# EAGLE design untitled (EAGLE 9.6.2)
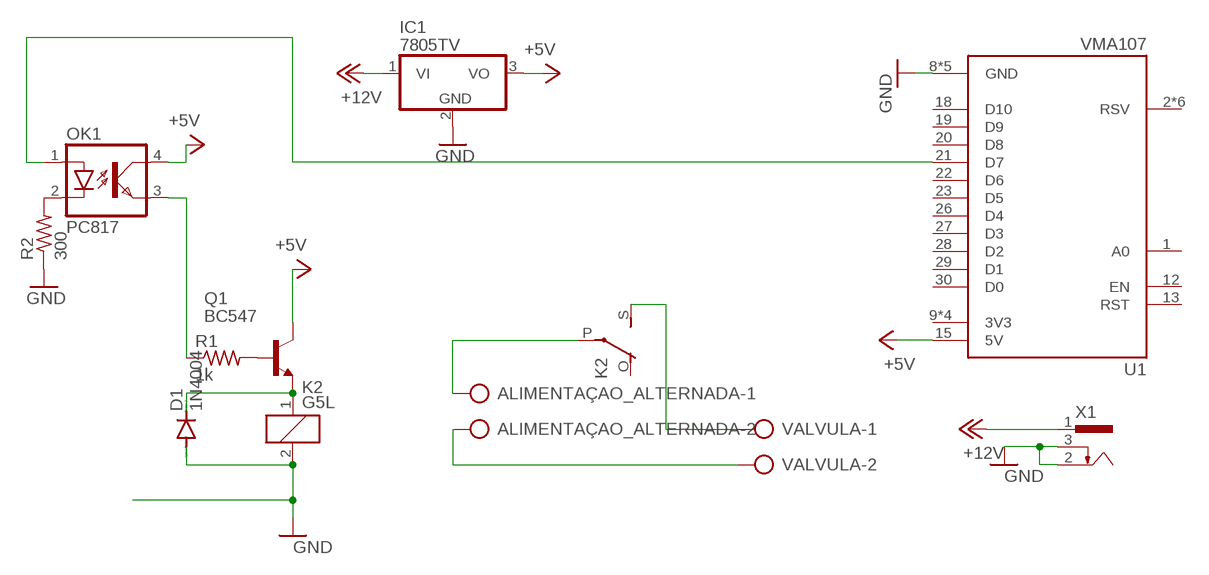
[diagram p0: schematic, sheet 1]

## Parts
ALIMENTAÇAO_ALTERNADA  AK500/2-H  [AK500/2-H]
D1  1N4004  [DO41-10]
IC1  7805TV  [TO220V]
K2  G5L  [G5LE]
OK1  PC817  [DIL04]
Q1  BC547  [TO92]
R1  1k  R-US_0204/7  [0204/7]
R2  300  R-US_0204/7  [0204/7]
U1  VMA107  [MODULE_VMA107]
VALVULA  AK500/2-H  [AK500/2-H]
X1  733980-62  [733980-62]

## Nets
+5V: IC1.3(VO) OK1.4(COL) Q1.3(C) U1.15(5V)
+12V: IC1.1(VI) X1.1
GND: D1.A IC1.2(GND) K2.2 R2.1 U1.8(GND) U1.10(GND) U1.14(GND) U1.17(GND) U1.24(GND) X1.2 X1.3
N$1: D1.C K2.1 Q1.1(E)
N$2: OK1.3(EMIT) R1.1
N$3: Q1.2(B) R1.2
N$4: OK1.2(C) R2.2
N$5: OK1.1(A) U1.21(D7)
N$6: ALIMENTAÇAO_ALTERNADA.1 K2.P(2:P)
N$7: K2.S(2:S) VALVULA.1
N$8: ALIMENTAÇAO_ALTERNADA.2 VALVULA.2
Unconnected: K2.O(2:O) U1.1(A0) U1.2(RSV) U1.3(RSV) U1.4(RSV) U1.5(RSV) U1.6(RSV) U1.7(RSV) U1.12(EN) U1.13(RST) U1.18(D10) U1.19(D9) U1.20(D8) U1.22(D6) U1.23(D5) U1.26(D4) U1.27(D3) U1.28(D2) U1.29(D1) U1.30(D0)

## Power pins joined to a net without a drawn wire
3V3: U1.9(3V3) U1.11(3V3) U1.16(3V3) U1.25(3V3)

## Library data of the parts
ALIMENTAÇAO_ALTERNADA VALVULA = con-ptr500:AK500/2-H: CONNECTOR Aug. 2004 / PTR Meßtechnik: Die Bezeichnung der Serie AK505 wurde geändert. Es handelt sich hierbei um AK500 in horizontaler Ausführung.; OC_FARNELL: unknown; OC_NEWARK: unknown
D1 = diode_longPad:1N4004: DIODE general purpose rectifier, 1 A
IC1 = linear:78*: Positive VOLTAGE REGULATOR Source: http://cache.national.com/ds/LM/LM78L05.pdf http://www.fairchildsemi.com/ds/LM/LM7805.pdf
K2 = relay:G5L: RELAY 1 x switch, 10 A/120 V AC, 8 A/30 V ADC, Omron; OC_FARNELL: unknown; OC_NEWARK: unknown
OK1 = optocoupler:PC817: SHARP OPTO COUPLER; MPN: PC817X4J000F; OC_FARNELL: 9707727; OC_NEWARK: 97K7059
Q1 = transistor-npn:BC547*: NPN Transistor
R1 R2 = rcl_robotica:R-US_: RESISTOR, American symbol; SPICEPREFIX: R
U1 = nodemcu3:VMA107: NodeMCU V2 Lua Based ESP8266 Development Board Check availability <https://pricing.snapeda.com/parts/VMA107/Velleman/view-part?ref=eda>; AVAILABILITY: Not in stock; CHECK_PRICES: https://www.snapeda.com/parts/VMA107/Velleman/view-part/?ref=eda; DESCRIPTION: NodeMCU V2 Lua Based ESP8266 Development Board; MF: Velleman; MP: VMA107; PACKAGE: None; PRICE: None; SNAPEDA_LINK: https://www.snapeda.com/parts/VMA107/Velleman/view-part/?ref=snap
X1 = con-conrad:73398?: FEMALE PRINT CONNECTOR Niedervolt-Steckverbinder Distributor Conrad

## Board
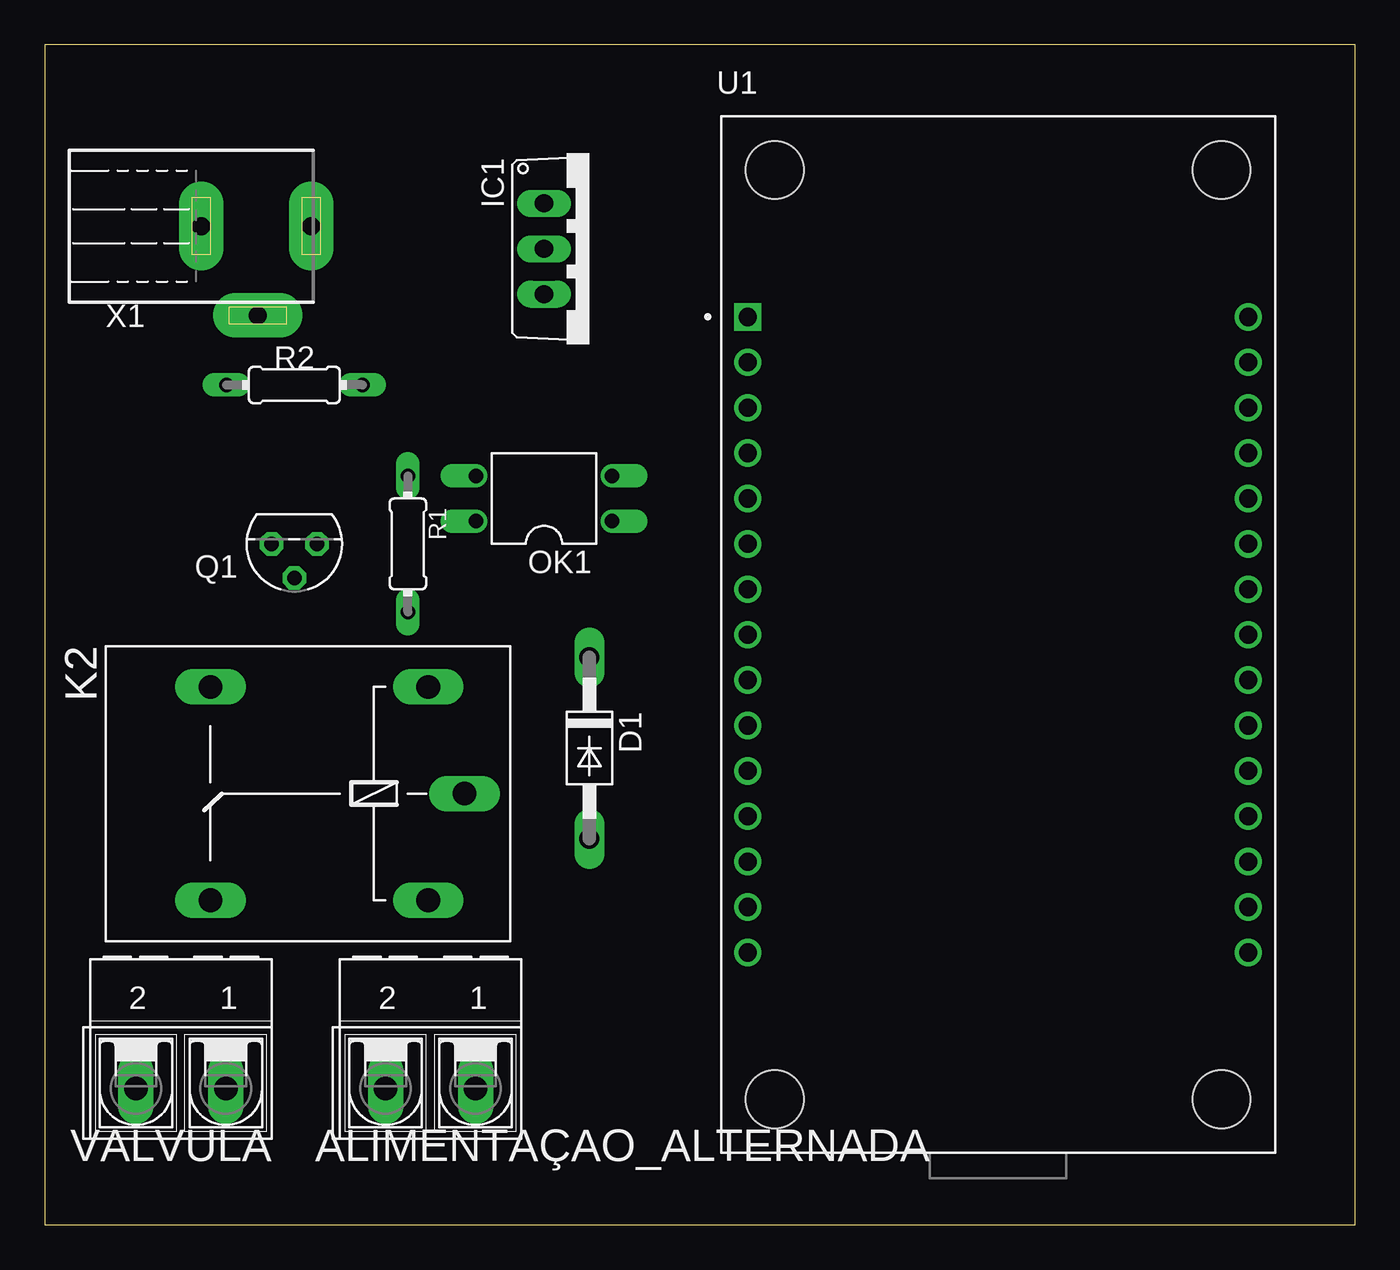
[diagram p1: board, top side]
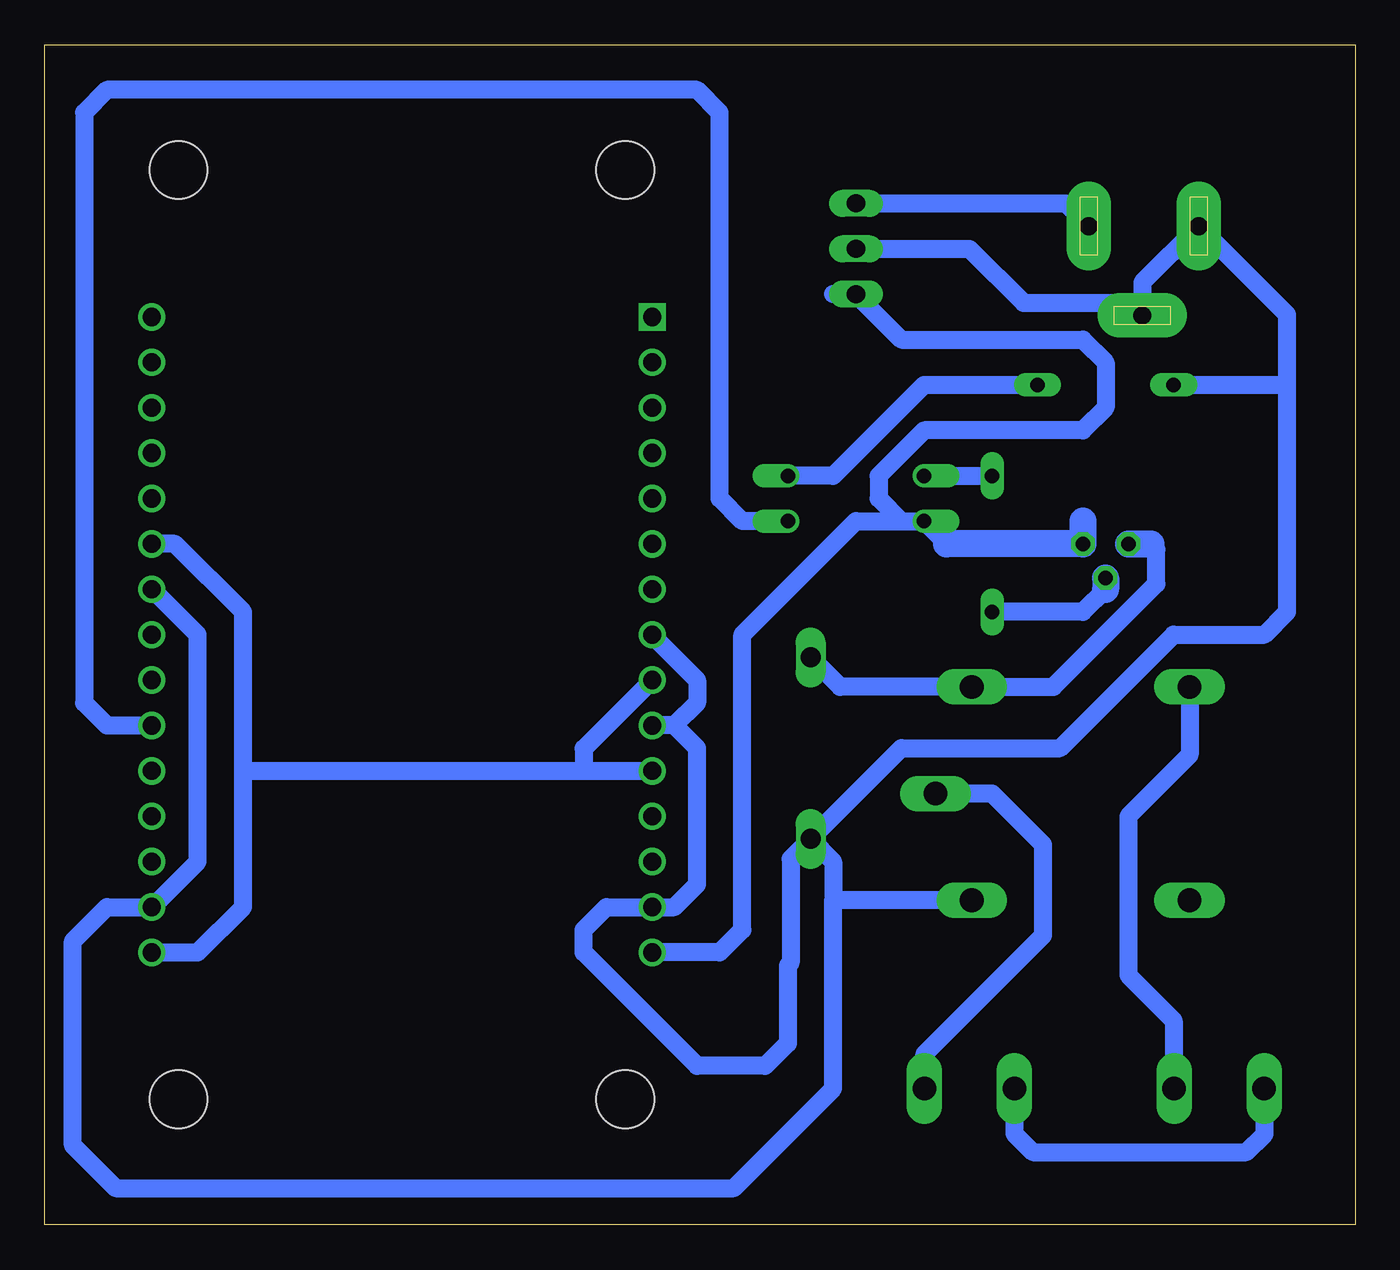
[diagram p2: board, bottom side, seen from below]

Size 73.33 x 66.03 mm. Coordinates in mm from the lower left corner, seen from the top.
Outline: 0,0 73.33,0 73.33,66.03 0,66.03 0,0
Copper layers (1*16): Top 0.035mm / dielectric 1.5mm / Bottom 0.035mm
Design rules "default *": minimum track width 6mil, minimum drill 0.35mm, track to track 16mil, track to pad 16mil, pad to pad 16mil, via to via 6mil, smd to smd 6mil, copper to edge 40mil, drill to drill 6mil, minimum pad ring 10mil, minimum via ring 8mil, stop-mask expansion 4mil, vias tented up to drill 0mil, thermal gap 10mil

### Footprints (pad centres in the part's own frame; a part is rotated, then mirrored left to right if it is on the bottom)
AK500/2-H = drill 1.321 long: 1 -2.515,0; 2 2.515,0
DO41-10 = drill 1.118 long: A 5.08,0; C -5.08,0
TO220V = drill 1.016 long: 1 -2.54,-2.54; 2 0,-2.54; 3 2.54,-2.54
G5LE = drill 1.321 long: 1 -7.493,-5.969; 2 -7.493,5.969; O 4.699,5.969; P -9.525,0; S 4.699,-5.969
DIL04 = drill 0.813 offset: 1 -1.27,-3.81; 2 1.27,-3.81; 3 1.27,3.81; 4 -1.27,3.81
TO92 = drill 0.813 octagon: 1 1.27,0; 2 0,1.905; 3 -1.27,0
0204/7 = drill 0.813 long: 1 -3.81,0; 2 3.81,0
MODULE_VMA107 = drill 1.02 square: 1 -14,17.78 | drill 1.02: 2 -14,15.24; 3 -14,12.7; 4 -14,10.16; 5 -14,7.62; 6 -14,5.08; 7 -14,2.54; 8 -14,0; 9 -14,-2.54; 10 -14,-5.08; 11 -14,-7.62; 12 -14,-10.16; 13 -14,-12.7; 14 -14,-15.24; 15 -14,-17.78; 16 14,-17.78; 17 14,-15.24; 18 14,-12.7; 19 14,-10.16; 20 14,-7.62; 21 14,-5.08; 22 14,-2.54; 23 14,0; 24 14,2.54; 25 14,5.08; 26 14,7.62; 27 14,10.16; 28 14,12.7; 29 14,15.24; 30 14,17.78 | hole 3.25: -12.5,-26; -12.5,26; 12.5,26; 12.5,-26
733980-62 = drill 1 pad 2.5 long: 1 0,8.57; 2 0,2.42; 3 5,5.57

### Placement (x,y rotation side)
ALIMENTAÇAO_ALTERNADA  21.59,7.62 180 top
D1  30.48,26.67 270 top
IC1  30.48,54.61 270 top
K2  13.97,24.13 180 top
OK1  27.94,40.64 90 top
Q1  13.97,38.1 180 top
R1  20.32,38.1 270 top
R2  13.97,46.99 0 top
U1  53.34,33.02 0 top
VALVULA  7.62,7.62 180 top
X1  6.35,55.88 270 top

### Tracks (layer width: path | path; a pad name or v marks a point on that pad's centre or on a via)
3V3
  Bottom 1.016: U1.16 64.77,15.24 62.23,17.78 62.23,25.4 | 62.23,25.4 62.23,34.29 66.04,38.1 U1.25 | 62.23,25.4 43.18,25.4 | 43.18,25.4 U1.11 | U1.9 43.18,26.64 43.18,25.4
+5V
  Bottom 1.016: 29.21,52.07 IC1.3 25.4,49.53 15.24,49.53 13.97,48.26 13.97,45.72 15.24,44.45 24.13,44.45 26.67,41.91 26.67,40.64 25.4,39.37 | 22.86,38.1 OK1.4 25.4,39.37 | U1.15 35.56,15.24 34.29,16.51 34.29,33.02 27.94,39.37 25.4,39.37
  Bottom 1.5: 15.24,39.37 Q1.3 22.86,38.1
+12V
  Bottom 1.016: IC1.1 16.19,57.15 X1.1
GND
  Bottom 1.016: 29.21,18.16 29.21,7.62 34.77,2.06 69.37,2.06 71.75,4.45 71.75,15.88 69.85,17.78 U1.17 67.31,17.78 64.77,20.32 64.77,33.02 67.31,35.56 U1.24 | D1.A 29.21,20.32 29.21,18.16 | X1.3 11.92,51.58 18.56,51.58 21.59,54.61 IC1.2 | K2.2 29.21,18.16 | D1.A 25.4,26.67 16.51,26.67 10.16,33.02 5.08,33.02 3.81,34.29 3.81,46.99 | 3.81,46.99 3.81,50.92 X1.2 11.92,52.73 X1.3 | X1.3 12,50.8 | R2.1 3.81,46.99 | 38.1,27.94 36.83,26.67 36.83,19.05 38.1,17.78 U1.14 41.91,17.78 43.18,16.51 43.18,15.24 36.83,8.89 33.02,8.89 31.75,10.16 31.75,14.5 31.6,14.65 31.6,20.47 D1.A | U1.8 39.34,32.99 36.83,30.48 36.83,29.21 38.1,27.94 | 38.1,27.94 U1.10
N$1
  Bottom 1.016: D1.C 28.83,30.1 K2.1 16.89,30.1 11.12,35.87 11.12,37.8 11.43,38.1
  Bottom 1.5: Q1.1 11.43,38.1
N$2
  Bottom 1.016: OK1.3 R1.1
N$3
  Bottom 1.016: R1.2 15.24,34.29 13.97,35.56
  Bottom 1.5: Q1.2 13.97,35.56
N$4
  Bottom 1.016: R2.2 24.13,46.99 29.21,41.91 OK1.2
N$5
  Bottom 1.016: OK1.1 34.29,39.37 35.56,40.64 35.56,62.23 36.83,63.5 69.85,63.5 71.12,62.23 71.12,29.21 69.85,27.94 U1.21
N$6
  Bottom 1.016: ALIMENTAÇAO_ALTERNADA.1 24.11,9.55 17.46,16.19 17.46,21.27 20.32,24.13 K2.P
N$7
  Bottom 1.016: VALVULA.1 10.16,7.64 10.16,11.43 12.7,13.97 12.7,22.86 9.27,26.29 K2.S
N$8
  Bottom 1.016: ALIMENTAÇAO_ALTERNADA.2 19.07,5.11 18.03,4.06 6.1,4.06 5.08,5.08 5.08,7.6 VALVULA.2